# Altium project firstprojecttut.PrjPcb
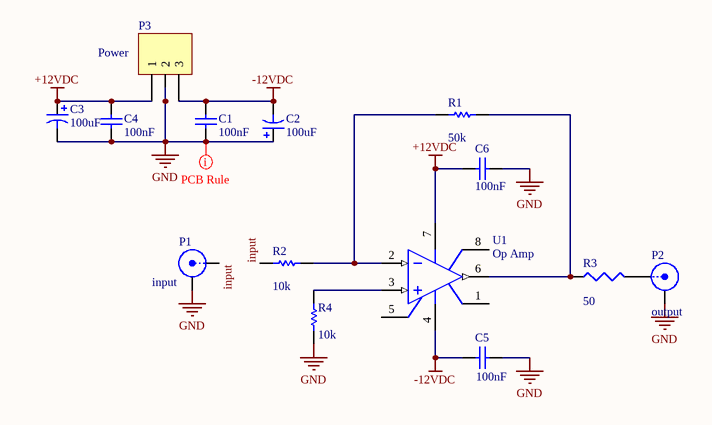
[diagram p0: dummyschematicfile.SchDoc]
1 sheet, 14 parts. Net scope: global (net labels, ports and power ports of the same name join across sheets).
Board file: dummypcbfile.PcbDoc

## Sheet dummyschematicfile.SchDoc
size Letter

### Parts
C1  value 100nF  [RAD-0.1]  (hidden comment: Cap)
C2  value 100uF  [C2512]  (hidden comment: Cap Pol1)
C3  value 100uF  [C2512]  (hidden comment: Cap Pol1)
C4  value 100nF  [RAD-0.1]  (hidden comment: Cap)
C5  value 100nF  [6-0805_N]  (hidden comment: Cap)
C6  value 100nF  [6-0805_M]  (hidden comment: Cap)
P1  input  [BNC_RA CON]
P2  output  [BNC_RA CON]
P3  Power  [HDR1X3H]
R1  value 50k  [AXIAL-0.3]  (hidden comment: Res1)
R2  value 10k  [AXIAL-0.3]  (hidden comment: Res1)
R3  value 50  [J1-0603]  (hidden comment: Res3)
R4  value 10k  [AXIAL-0.3]  (hidden comment: Res1)
U1  Op Amp  [DIP-8]

### Nets
+12VDC: C3.1 C4.1 C6.1 P3.1 U1.7(V+)
-12VDC: C1.1 C2.2 C5.2 P3.3 U1.4(V-)
GND: C1.2 C2.1 C3.2 C4.2 C5.1 C6.2 P1.2(Y) P2.2(Y) P3.2 R4.1
input: P1.1(X) R2.1
NetP2_1: P2.1(X) R3.2
NetR1_1: R1.1 R2.2 U1.2(IN-)
NetR1_2: R1.2 R3.1 U1.6(OUT)
NetR4_2: R4.2 U1.3(IN+)

Not connected (* = marked no-connect by the designer): U1 1(OS_NUL) 5(OS_NUL) 8(TAB)

### Layout directives
rule Width Constraint [Pref Width = 25mil    Min Width = 20mil    Max Width = 30mil]: GND

### Library data of the parts
C1 C4-C6 = Cap: Capacitor; Published: 8-Jun-2000; LatestRevisionDate: 17-Jul-2002; LatestRevisionNote: Re-released for DXP Platform.; PackageReference: RAD-0.3; Publisher: Altium Limited; PackageDescription: Radial Cap, Thru-Hole; 2 Leads; 0.3 in Pin Spacing
C2 C3 = Cap Pol1: Polarized Capacitor (Radial); Published: 8-Jun-2000; LatestRevisionDate: 17-Jul-2002; LatestRevisionNote: Re-released for DXP Platform.; PackageReference: RB7.6-15; Publisher: Altium Limited; PackageDescription: Polarized Capacitor (Radial); 2 Leads
P1 P2 = BNC: BNC Elbow Connector; LatestRevisionDate: 17-Jul-2002; LatestRevisionNote: Re-released for DXP Platform.; Publisher: Altium Limited
P3 = Header 3H: Header, 3-Pin, Right Angle; LatestRevisionDate: 17-Jul-2002; LatestRevisionNote: Re-released for DXP Platform.; Publisher: Altium Limited
R1 R2 R4 = Res1: Resistor; Published: 8-Jun-2000; LatestRevisionDate: 17-Jul-2002; LatestRevisionNote: Re-released for DXP Platform.; PackageReference: AXIAL-0.3; Publisher: Altium Limited; PackageDescription: Axial Device, Thru-Hole; 2 Leads; 0.3 in Pin Spacing
R3 = Res3: Resistor; Published: 8-Jun-2000; LatestRevisionDate: 29-May-2009; LatestRevisionNote: IPC-7351 Footprint Added.; PackageReference: J1-0603; Publisher: Altium Limited; PackageDescription: Chip Resistor
U1 = Op Amp: FET Operational Amplifier; Published: 8-Jun-2000; LatestRevisionDate: 17-Jul-2002; LatestRevisionNote: Re-released for DXP Platform.; DatasheetVersion: REV. B; PackageVersion: 1990; PackageReference: H-08A; Publisher: Altium Limited; PackageDescription: Can; 8 Leads; Pin Circle Dia. 5.08 mm; Lead Dia. 0.53 mm (max); ComponentLink1Description: Manufacturer Link; ComponentLink1URL: http://www.analog.com/